# EAGLE design Firefly (EAGLE 6.2)
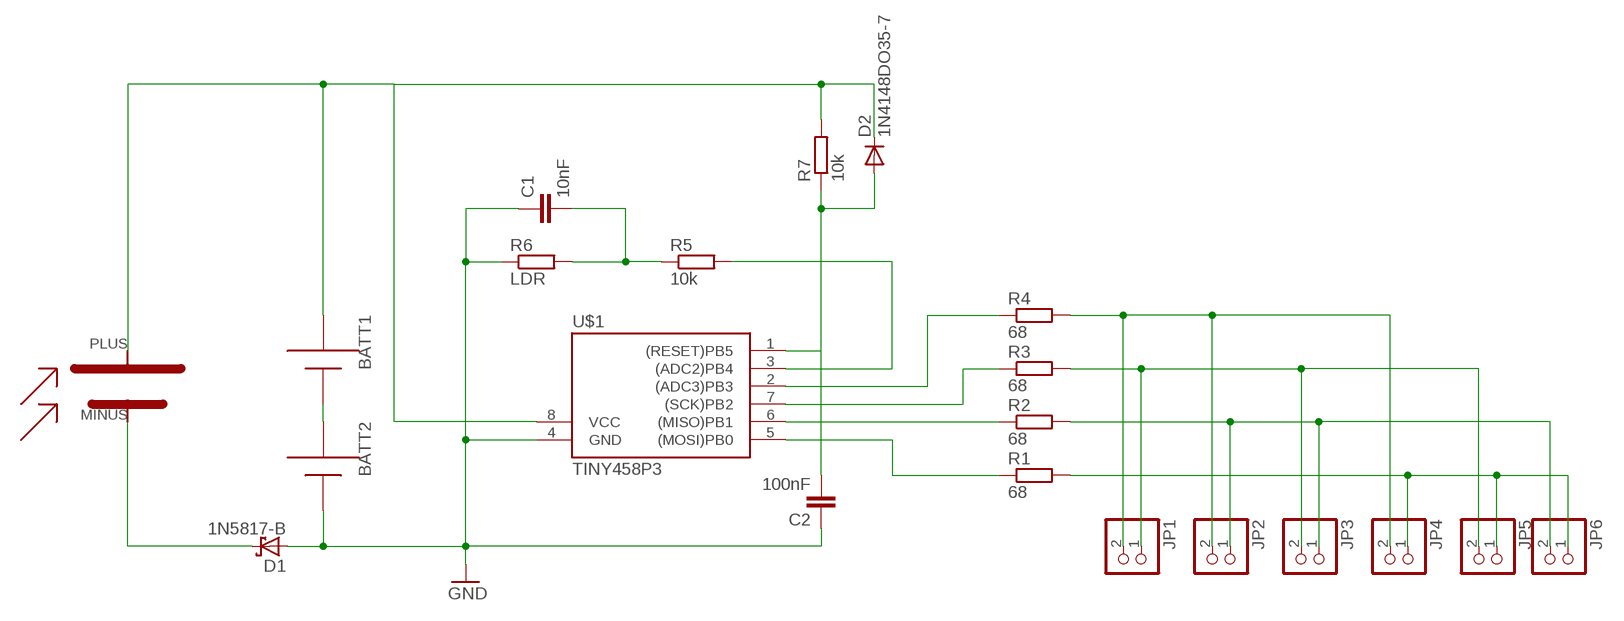
[diagram p0: schematic, sheet 1]

## Parts
BATT1  AAA  [12BH412]
BATT2  AAA  [12BH412]
C1  10nF  C-EU025-025X050  [C025-025X050]
C2  100nF  C-EU075-032X103  [C075-032X103]
D1  1N5817-B  [DO41-7.6]
D2  1N4148DO35-7  [DO35-7]
JP1  PINHD-1X2  [1X02]
JP2  PINHD-1X2  [1X02]
JP3  PINHD-1X2  [1X02]
JP4  PINHD-1X2  [1X02]
JP5  PINHD-1X2  [1X02]
JP6  PINHD-1X2  [1X02]
R1  68  R-EU_0204/7  [0204/7]
R2  68  R-EU_0204/7  [0204/7]
R3  68  R-EU_0204/7  [0204/7]
R4  68  R-EU_0204/7  [0204/7]
R5  10k  R-EU_0207/10  [0207/10]
R6  LDR  R-EU_0204/7  [0204/7]
R7  10k  R-EU_0204/7  [0204/7]
U$1  TINY458P3  [DIL08]
U$2  SOLARCELL4V35MACONRAD  [SOLARCELL35X39]

## Nets
GND: BATT2.- C1.1 C2.1 D1.A R6.1 U$1.4(GND)
N$1: R1.1 U$1.5((MOSI)PB0)
N$2: R2.1 U$1.6((MISO)PB1)
N$3: R3.1 U$1.7((SCK)PB2)
N$4: R4.1 U$1.2((ADC3)PB3)
N$5: JP1.2 JP2.2 JP4.2 R4.2
N$6: BATT1.- BATT2.+
N$7: JP2.1 JP3.1 JP6.2 R2.2
N$8: JP1.1 JP3.2 JP5.2 R3.2
N$9: C2.2 D2.A R7.1 U$1.1((RESET)PB5)
N$10: JP4.1 JP5.1 JP6.1 R1.2
N$11: BATT1.+ D2.C R7.2 U$1.8(VCC) U$2.PLUS
N$12: D1.C U$2.MINUS
N$13: R5.2 U$1.3((ADC2)PB4)
N$14: C1.2 R5.1 R6.2

## Library data of the parts
BATT1 BATT2 = adafruit:AAA: AAA PC pin holder Mouser part #12BH412 - but pretty much any 1x AAA battery holder should be the same http://www.ladyada.net/library/pcb/eaglelibrary.html
C1 C2 = resistor:C-EU: CAPACITOR, European symbol
D1 = diode:1N581*: 1.0A SCHOTTKY BARRIER RECTIFIER Source: http://www.diodes.com/datasheets/ds23001.pdf
D2 = diode:1N4148: DIODE high speed (Philips)
JP1-JP6 = pinhead:PINHD-1X2: PIN HEADER
R1-R7 = resistor:R-EU_: RESISTOR, European symbol
U$1 = firefly:TINY45*
U$2 = firefly:SOLARCELL4V35MACONRAD: Conrad Miniatur-Solarzellen Monokristallin Nennspannung 4 V Nennstrom 35 mA Technische Daten Nennspannung 4 V Nennstrom 35 mA Abm. (L x B) 39 mm x 35 mm Ausführung Monokristallin

## Board
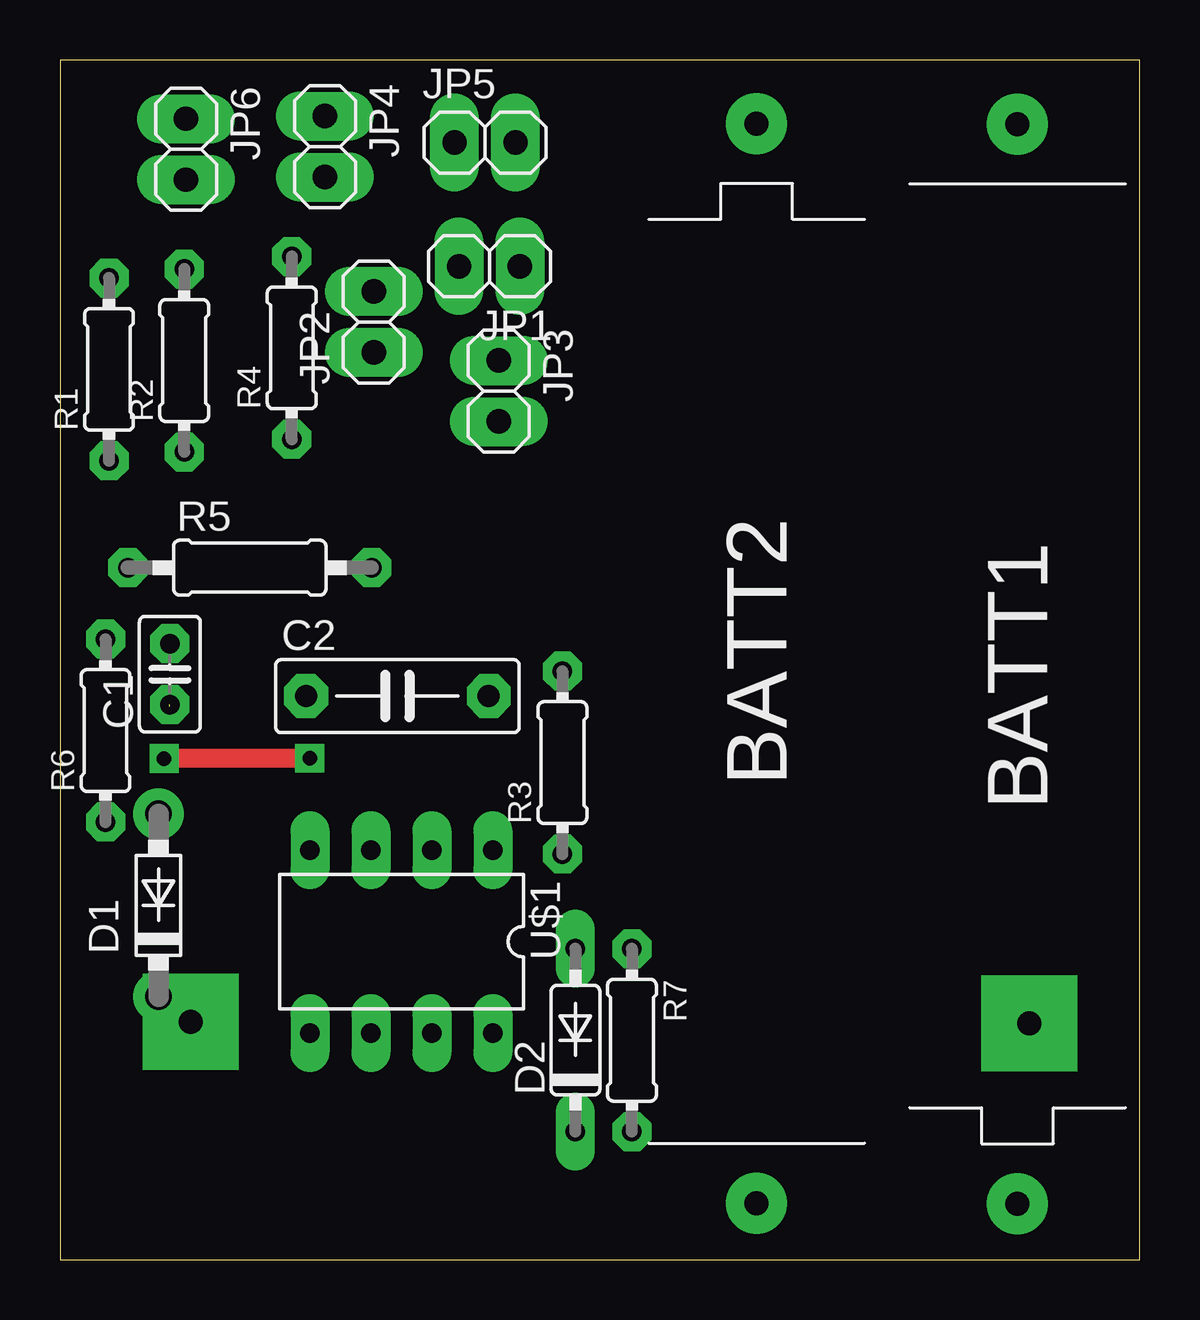
[diagram p1: board, top side]
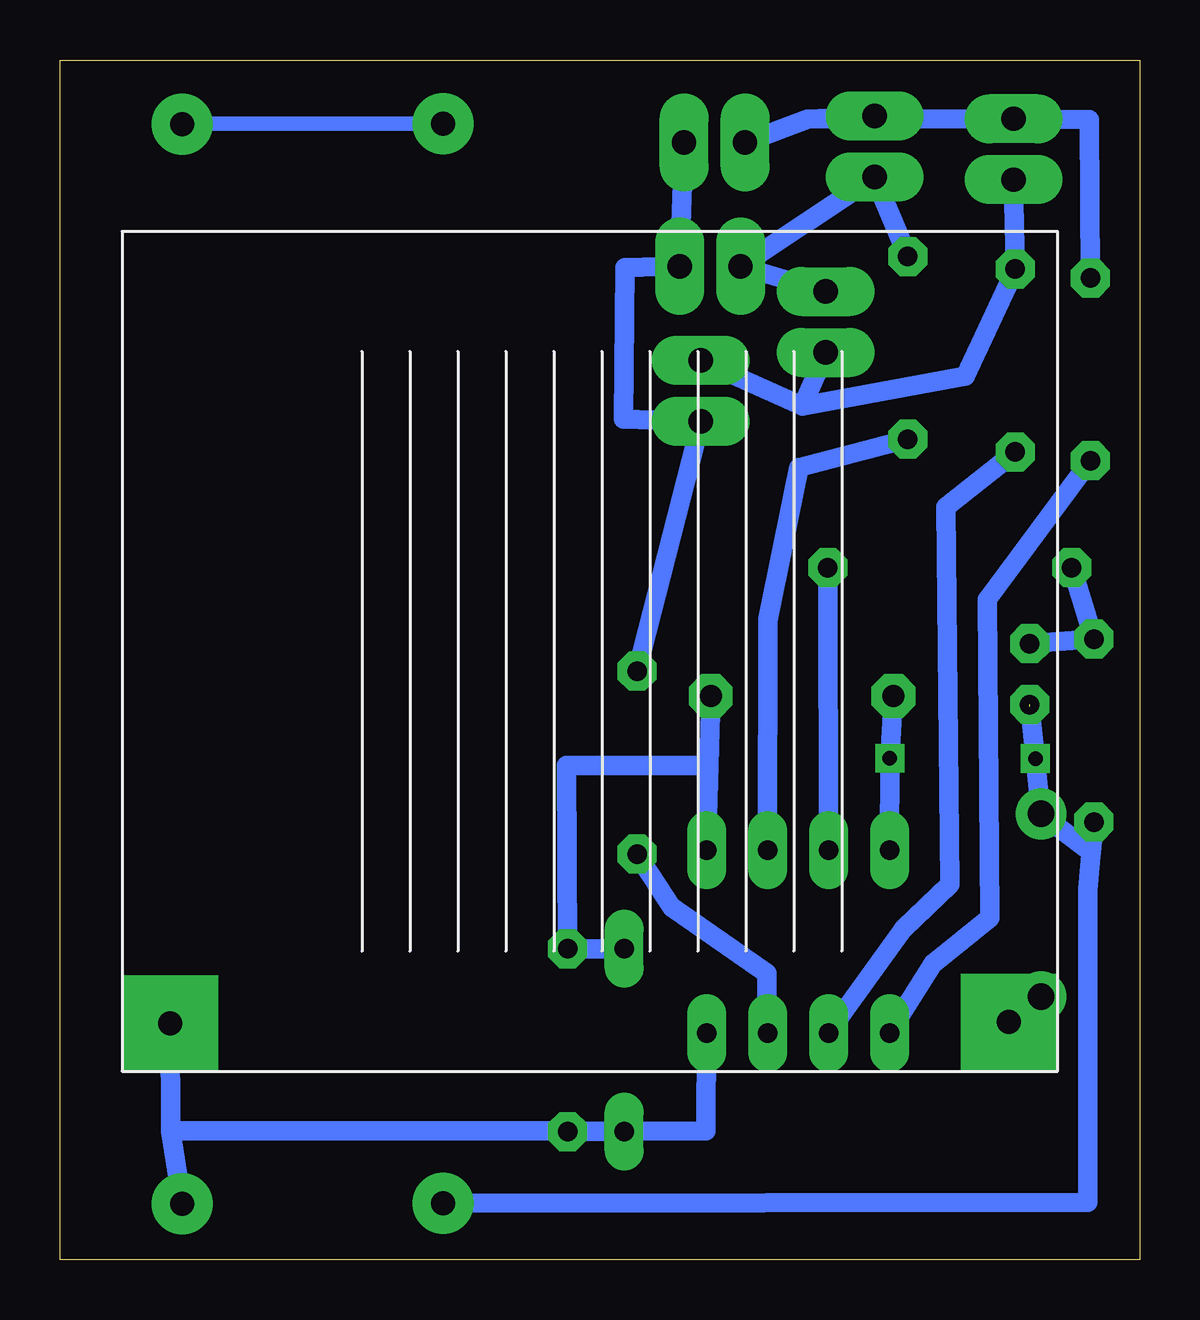
[diagram p2: board, bottom side, seen from below]

Size 45 x 50 mm. Coordinates in mm from the lower left corner, seen from the top.
Outline: 0,0 45,0 45,50 0,50 0,0
Copper layers (1*16): Top 0.035mm / dielectric 1.5mm / Bottom 0.035mm
Design rules: minimum track width 10mil, minimum drill 24mil, track to track 8mil, track to pad 8mil, pad to pad 8mil, via to via 8mil, smd to smd 8mil, copper to edge 40mil, drill to drill 8mil, minimum pad ring 10mil, minimum via ring 8mil, stop-mask expansion 4mil, vias tented up to drill 0mil, thermal gap 10mil

### Footprints (pad centres in the part's own frame; a part is rotated, then mirrored left to right if it is on the bottom)
12BH412 = drill 1 pad 2.54: + 22.5,0; - -22.5,0
C025-025X050 = drill 0.813 octagon: 1 -1.27,0; 2 1.27,0
C075-032X103 = drill 0.914 octagon: 1 -3.81,0; 2 3.81,0
DO41-7.6 = drill 1.1 pad 1.7: A 3.81,0; C -3.81,0
DO35-7 = drill 0.813 long: A 3.81,0; C -3.81,0
1X02 = drill 1.016 long: 1 -1.27,0; 2 1.27,0
0204/7 = drill 0.813 octagon: 1 -3.81,0; 2 3.81,0
0207/10 = drill 0.813 octagon: 1 -5.08,0; 2 5.08,0
DIL08 = drill 0.813 long: 1 -3.81,-3.81; 2 -1.27,-3.81; 3 1.27,-3.81; 4 3.81,-3.81; 5 3.81,3.81; 6 1.27,3.81; 7 -1.27,3.81; 8 -3.81,3.81
SOLARCELL35X39 = drill 1 pad 4 square: MINUS 36.96,2.07; PLUS 2,2

### Placement (x,y rotation side)
BATT1  39.91,24.83 270 top
BATT2  29.04,24.85 90 top
C1  4.58,24.4 90 top
C2  14.06,23.49 0 top
D1  4.11,14.77 90 top
D2  21.49,9.14 90 top
JP1  17.9,41.4 180 top
JP2  13.08,39.08 90 top
JP3  18.29,36.2 270 top
JP4  11.04,46.39 270 top
JP5  17.72,46.56 0 top
JP6  5.25,46.28 270 top
R1  2.04,37.1 90 top
R2  5.18,37.47 90 top
R3  20.94,20.71 90 top
R4  9.66,38 90 top
R5  7.91,28.84 0 top
R6  1.9,22.05 90 top
R7  23.84,9.14 270 top
U$1  14.23,13.25 180 top
U$2  42.42,7.84 0 bottom

### Tracks (layer width: path | path; a pad name or v marks a point on that pad's centre or on a via)
GND  (via drill 0.6)  (1 unrouted)
  Top 0.813: v4.34,20.88 v10.41,20.9
  Bottom 0.813: BATT2.- 2.16,2.38 2.16,15.43 R6.1 2.02,16.97 D1.A v4.34,20.88 4.58,23.06 | U$1.4 v10.41,20.9 C2.1
N$1
  Bottom 0.813: U$1.5 8.62,12.32 6.24,14.25 6.34,27.5 R1.1
N$2
  Bottom 0.813: U$1.6 9.84,13.79 7.91,15.64 8.07,31.36 R2.1
N$3
  Bottom 0.813: U$1.7 15.53,11.92 19.51,14.71 R3.1
N$4
  Bottom 0.813: R4.1 14.2,33 15.5,26.68 U$1.2
N$5
  Bottom 0.813: R4.2 JP4.2 JP1.2 JP2.2
N$6
  Bottom 0.406: 39.91,47.35 BATT1.-
  Bottom 0.61: BATT2.+ 39.91,47.35
N$7
  Bottom 0.813: JP3.1 14.04,35.57 | 14.04,35.57 JP2.1 | JP6.2 R2.2 7.26,36.81 14.04,35.57
N$8
  Bottom 0.813: R3.2 JP3.2 21.52,35.04 21.44,41.35 JP1.1 JP5.2
N$9
  Bottom 0.813: C2.2 U$1.1 17.98,20.59 23.89,20.59 R7.1 D2.A
N$10
  Bottom 0.813: JP4.1 13.85,47.54 | 13.85,47.54 JP5.1 | 13.85,47.54 JP6.1 2.09,47.51 R1.2
N$11
  Bottom 0.813: U$1.8 18.07,5.36 D2.C 24.21,5.35 | 24.21,5.35 24.53,5.36 40.39,5.36 | 40.39,5.36 BATT1.+ | 40.39,5.36 U$2.PLUS | R7.2 24.21,5.35
N$12
  Bottom 0.813: U$2.MINUS D1.C
N$13
  Bottom 0.813: U$1.3 R5.2
N$14
  Bottom 0.813: C1.2 R6.2 R5.1